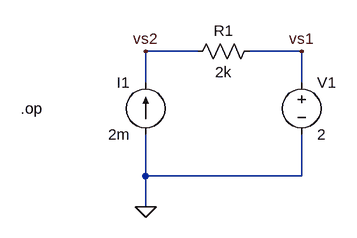
[diagram p0: schematic quiz1.asc]
quiz1.asc, the LTspice schematic file:
Version 4
SHEET 1 880 680
WIRE 160 -48 80 -48
WIRE 320 -48 240 -48
WIRE 80 0 80 -48
WIRE 320 0 320 -48
WIRE 80 144 80 80
WIRE 320 144 320 80
WIRE 320 144 80 144
WIRE 80 192 80 144
FLAG 80 -48 vs2
FLAG 320 -48 vs1
FLAG 80 192 0
SYMBOL voltage 320 -16 R0
WINDOW 123 0 0 Left 0
WINDOW 39 0 0 Left 0
SYMATTR InstName V1
SYMATTR Value 2
SYMBOL res 256 -64 R90
WINDOW 0 0 56 VBottom 2
WINDOW 3 32 56 VTop 2
SYMATTR InstName R1
SYMATTR Value 2k
SYMBOL current 80 80 R180
WINDOW 0 24 80 Left 2
WINDOW 3 24 0 Left 2
WINDOW 123 0 0 Left 0
WINDOW 39 0 0 Left 0
SYMATTR InstName I1
SYMATTR Value 2m
TEXT -112 40 Left 2 !.op

The netlist it stands for:
* quiz1.asc
V1 vs1 0 2
R1 vs1 vs2 2k
I1 0 vs2 2m
.op
.backanno
.end